# EAGLE design lightsensor-smd (EAGLE 5.10)
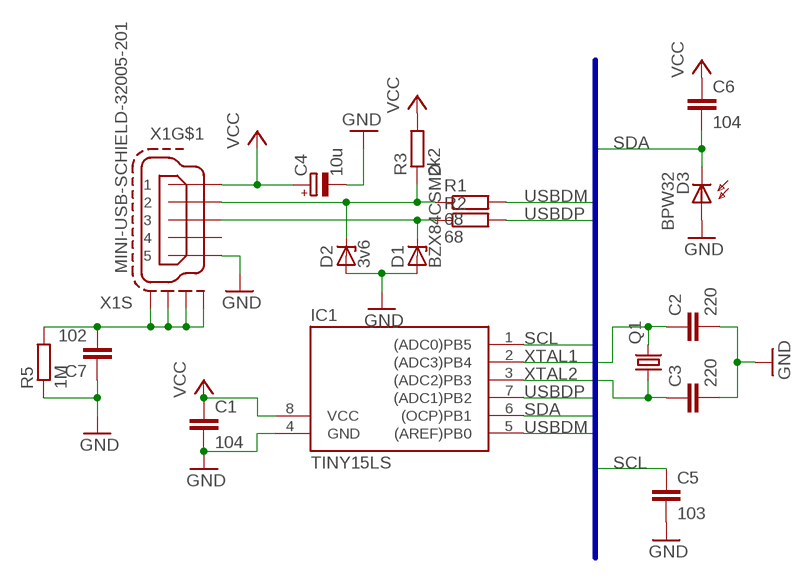
[diagram p0: schematic, sheet 1]

## Parts
C1  104  C-EUC0603  [C0603]
C2  220  C-EUC0805  [C0805]
C3  220  C-EUC0805  [C0805]
C4  10u  CPOL-EUSMCB  [SMC_B]
C5  103  C-EUC0805  [C0805]
C6  104  C-EUC0603  [C0603]
C7  102  C-EUC0805  [C0805]
D1  BZX84CSMD  [TO236]
D2  3v6  BZX84CSMD  [TO236]
D3  BPW32  [BPW32]
IC1  TINY15LS  [SOIC8]
Q1  CRYSTALHC49UP  [HC49UP]
R1  68  R-EU_R0603  [R0603]
R2  68  R-EU_R0603  [R0603]
R3  2k2  R-EU_R0603  [R0603]
R5  1M  R-EU_R0603  [R0603]
X1  MINI-USB-SCHIELD-32005-201  [32005-201]

## Nets
GND: C1.2 C2.2 C3.2 C4.- C5.2 C7.1 D1.A D2.A D3.A IC1.4(GND) R5.1 X1.5
N$1: D2.C R1.1 R3.1 X1.2
N$2: D1.C R2.1 X1.3
SCL: C5.1 IC1.1((ADC0)PB5)
SDA: C6.2 D3.K(C) IC1.6((OCP)PB1)
SHIELD: C7.2 R5.2 X1.M1(S:S1) X1.M2(S:S2) X1.M3(S:S3) X1.M4(S:S4)
USBDM: IC1.5((AREF)PB0) R1.2
USBDP: IC1.7((ADC1)PB2) R2.2
VCC: C1.1 C4.+ C6.1 IC1.8(VCC) R3.2 X1.1
XTAL1: C2.1 IC1.2((ADC3)PB4) Q1.2
XTAL2: C3.1 IC1.3((ADC2)PB3) Q1.1
Unconnected: X1.4

## Buses
USBDM,USBDP,SCL,SDA

## Library data of the parts
C1-C3 C5-C7 = rcl:C-EU: CAPACITOR, European symbol
C4 = rcl:CPOL-EU: POLARIZED CAPACITOR, European symbol
D1 D2 = diode:BZX84CSMD: Z DIODE
D3 = opto-trans-siemens:BPW32: PHOTO DIODE
IC1 = atmel:TINY15L: MICROCONTROLLER 2.7 V 1 Kbytes FLASH 64 bytes EEPROM 4-channel 10 bit ADC
Q1 = crystal:CRYSTAL: CRYSTAL
R1-R3 R5 = rcl:R-EU_: RESISTOR, European symbol
X1 = con-cypressindustries:MINI-USB-SCHIELD-: MINI USB-B Conector Source: www.cypressindustries.com

## Board
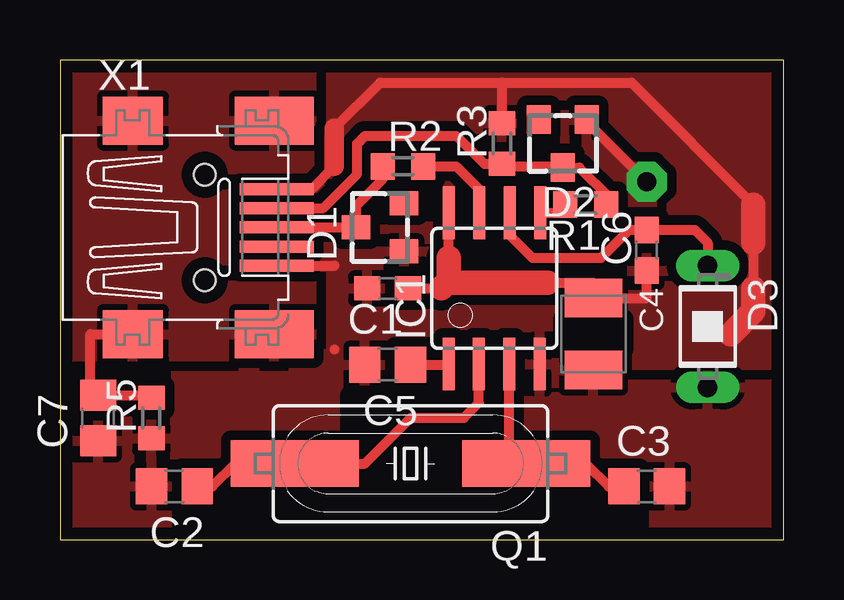
[diagram p1: board, top side]
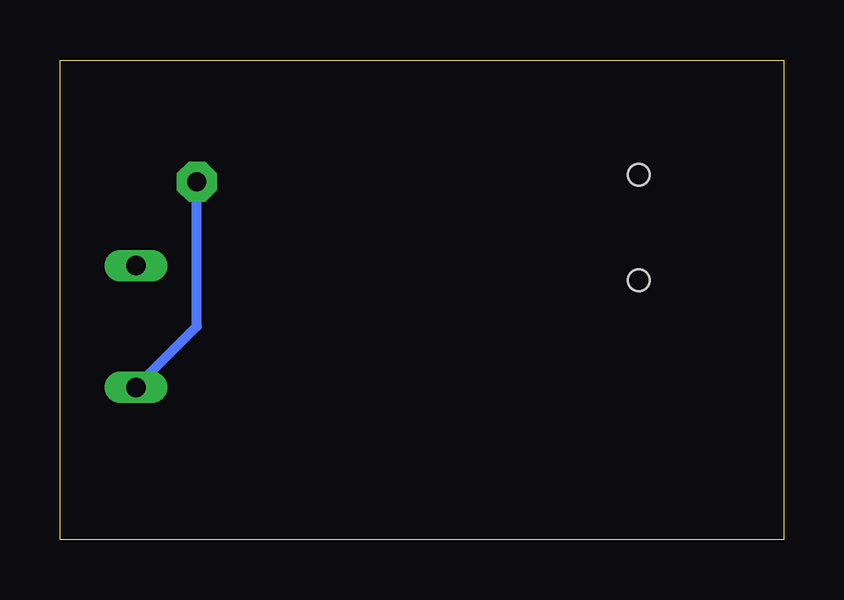
[diagram p2: board, bottom side, seen from below]

Size 30.15 x 19.99 mm. Coordinates in mm from the lower left corner, seen from the top.
Outline: 0,0 30.15,0 30.15,19.99 0,19.99 0,0
Copper layers (1*16): Top 0.035mm / dielectric 1.5mm / Bottom 0.035mm
Design rules "default *": minimum track width 10mil, minimum drill 24mil, track to track 8mil, track to pad 8mil, pad to pad 8mil, via to via 8mil, smd to smd 8mil, copper to edge 20mil, drill to drill 8mil, minimum pad ring 10mil, minimum via ring 8mil, stop-mask expansion 4mil, vias tented up to drill 0mil, thermal gap 10mil
tRestrict: area 12.1,4.4 to 13,6; area 5.1,0.3 to 7,1; area 22.2,0.3 to 24.1,1; area 21,7.9 to 23.5,9.2

### Footprints (pad centres in the part's own frame; a part is rotated, then mirrored left to right if it is on the bottom)
C0603 = smd 1.1 x 1: 1 -0.85,0; 2 0.85,0
C0805 = smd 1.3 x 1.5: 1 -0.95,0; 2 0.95,0
SMC_B = smd 1.6 x 2.4: + -1.5,0; - 1.5,0
TO236 = smd 1 x 1.2: A -1,-1; C 0,1; NC 1,-1
BPW32 = drill 0.813 long: A 0,2.54; K 0,-2.54
SOIC8 = smd 0.5 x 2.2: 1 -1.905,-3.154; 2 -0.645,-3.154; 3 0.625,-3.154; 4 1.895,-3.154; 5 1.905,3.154; 6 0.635,3.154; 7 -0.635,3.154; 8 -1.905,3.154
HC49UP = smd 5.334 x 1.93: 1 -4.826,0; 2 4.826,0
R0603 = smd 1 x 1.1: 1 -0.85,0; 2 0.85,0
32005-201 = smd 3.1 x 0.5: 1 3,1.6; 2 3,0.8; 3 3,0; 4 3,-0.8; 5 3,-1.6 | smd 2.5 x 2: M1 -3,-4.45; M2 -3,4.45 | smd 3.3 x 2: M3 2.9,4.45; M4 2.9,-4.45 | hole 0.9: 0,2.2; 0,-2.2

### Placement (x,y rotation side)
C1  13.65,10.48 180 top
C2  4.76,2.22 180 top
C3  24.45,2.22 0 top
C4  22.23,8.57 270 top
C5  13.65,7.3 180 top
C6  24.45,12.06 90 top
C7  1.59,5.08 90 top
D1  13.34,13.02 90 top
D2  20.95,16.51 180 top
D3  26.99,8.89 180 top
IC1  18.1,10.48 0 top
Q1  14.61,3.17 180 top
R1  21.91,13.97 180 top
R2  14.29,15.56 0 top
R3  18.41,16.51 90 top
R5  3.81,5.08 90 top
X1  6.03,13.02 0 top

### Tracks (layer width: path | path; a pad name or v marks a point on that pad's centre or on a via)
GND  (via drill 0.8 pad 1.68)
  Top 0.406: 11.43,7.93 11.43,7.94 | D2.A 21.95,17.41 v24.45,14.92 | X1.5 11.42,11.42 11.43,11.43
  Bottom 0.406: v24.45,14.92 24.45,8.89 D3.A
  pour Top (isolate 0.406, rank 6): 0,20 30.16,20 30.16,0 0,0
N$1
  Top 0.406: R1.1 22.86,14.07 22.86,14.29 21.64,15.51 D2.C 20.91,15.56 18.52,15.56 R3.1 17.68,15.66 16.51,16.83 12.7,16.83 12.38,16.51 12.38,15.24 10.96,13.82 X1.2
N$2
  Top 0.406: R2.1 13.44,15.03 12.34,13.92 D1.C X1.3
SCL
  Top 0.406: C5.1 16.17,7.3 IC1.1
SDA
  Top 0.406: IC1.6 18.73,12.7 19.68,11.75 22.54,11.75 23.71,12.91 C6.2 26.45,12.91 26.99,12.38 D3.K
SHIELD
  Top 0.406: X1.M1 1.27,8.57 1.27,6.03 C7.2 3.81,6.03 R5.2
  pour Top (isolate 0.406): 0,20 10.48,20 10.48,7.62 0,7.62
USBDM
  Top 0.406: IC1.5 20.72,13.63 R1.2
USBDP
  Top 0.406: R2.2 16.51,15.56 17.46,14.61 IC1.7
VCC
  Top 0.406: 16.19,11.75 IC1.8 | 18.41,19.05 23.81,19.05 28.89,13.97 | 28.89,12.38 28.89,10.48 | 11.43,15.56 10.49,14.62 X1.1 | 18.41,19.05 R3.2 | 11.43,17.14 13.34,19.05 18.41,19.05 | C6.1 24.45,10.07 C4.+ 22.23,10.71 20.32,10.71 | C1.1 15.88,10.48
  Top 0.813: 11.43,15.56 11.43,17.14
  Top 1.016: 28.89,10.48 28.89,9.53 27.94,8.57 | 28.89,13.97 28.89,12.38 | 16.19,10.71 16.11,10.71 15.88,10.48 | 16.19,10.71 20.32,10.71 | 16.19,10.71 16.19,11.75
  pour Top (isolate 0.406, rank 2): 23.81,7.3 30.16,7.3 30.16,20 10.48,20 10.48,14.61 23.81,14.61
XTAL1
  Top 0.406: C2.1 6.35,2.22 7.3,3.17 Q1.2 12.7,3.17 14.61,5.08 16.83,5.08 17.45,5.71 IC1.2
XTAL2
  Top 0.406: IC1.3 18.72,3.88 Q1.1 21.91,3.17 22.86,2.22 C3.1